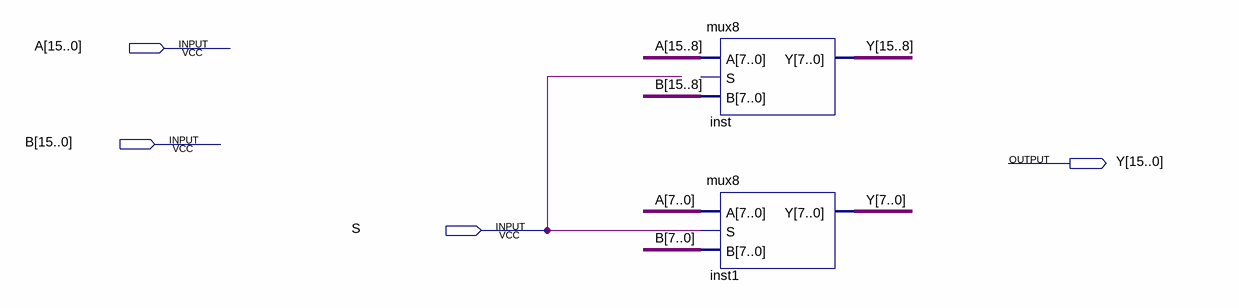
[diagram p0: schematic sheet]
// Quartus schematic mux16.bdf as structural Verilog: 2 symbols, 4 pins
module mux16 (
  input  [15:0] A,
  input  [15:0] B,
  input  S,
  output [15:0] Y
);

  mux8 inst (.A(A[15:8]), .B(B[15:8]), .Y(Y[15:8]));  // open: S
  mux8 inst1 (.A(A[7:0]), .S(S), .B(B[7:0]), .Y(Y[7:0]));
endmodule
